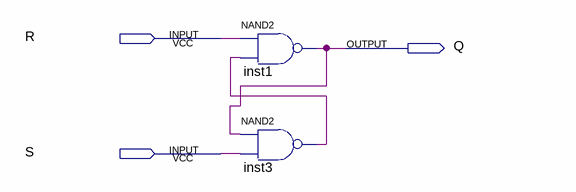
[diagram p0: schematic sheet]
// Quartus schematic rs_trigger_nand2.bdf as structural Verilog: 2 symbols, 3 pins
module rs_trigger_nand2 (
  input  R,
  input  S,
  output Q
);

  wire inst3_out;

  nand inst1 (Q, R, inst3_out);
  nand inst3 (inst3_out, Q, S);
endmodule
